# Altium schematic sheet Output Devices.SchDoc
size A; SheetNumber: 5; SheetTotal: 5
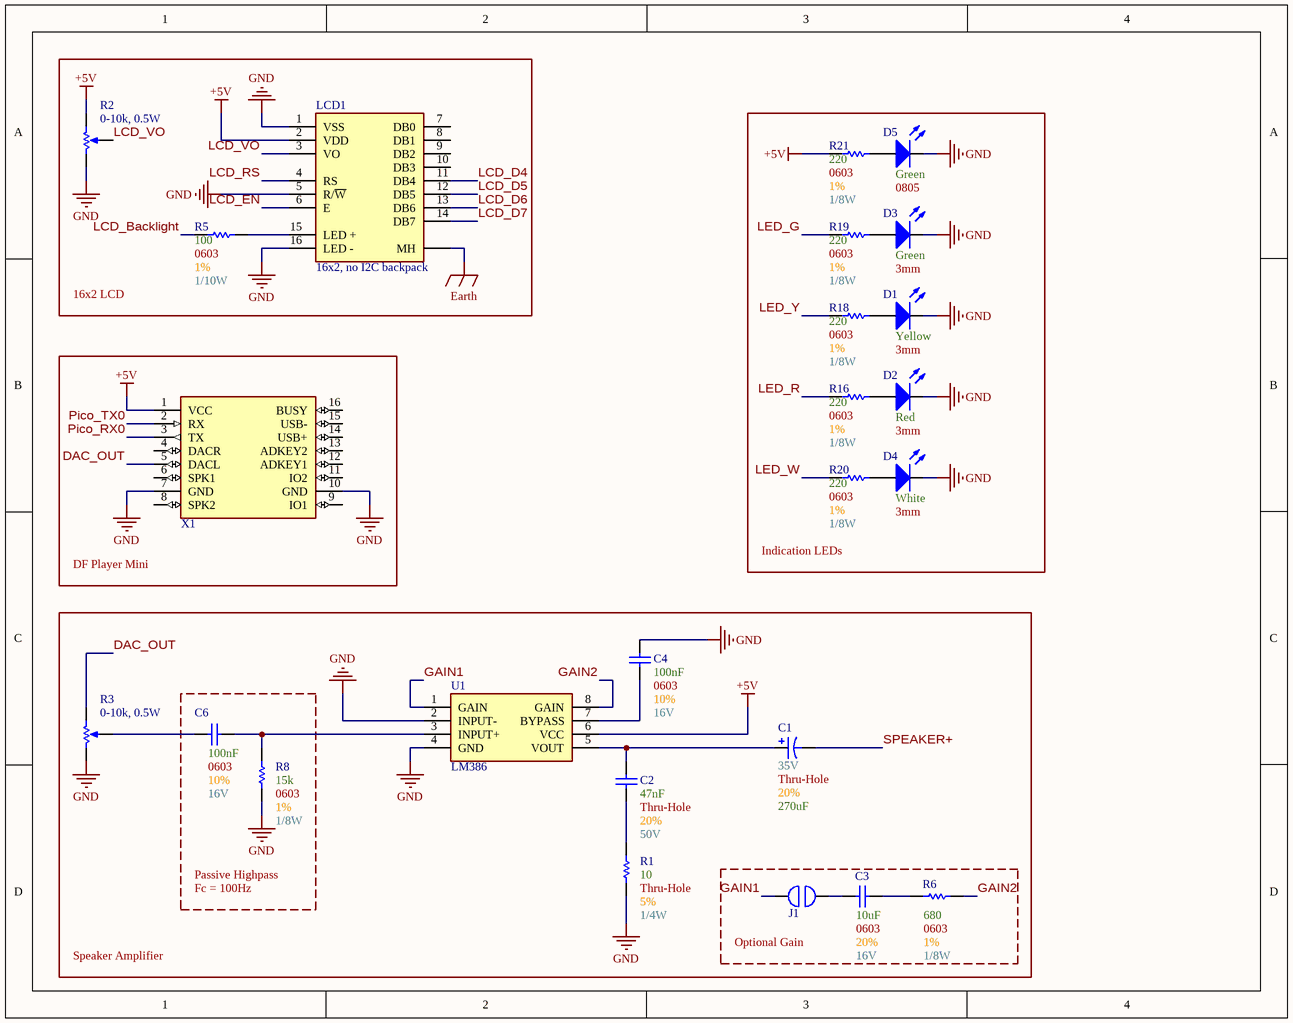
[diagram p0: Output Devices.SchDoc]

## Parts
C1  Max Voltage: 35V  Size Package: Thru-Hole  Tolerance: 20%  Capacitance: 270uF  [[Cap] Thru-Hole Polarized 8mm]  (hidden comment: [Cap] Thru-Hole 270uF 20% 35V)
C2  Max Voltage: 50V  Size Package: Thru-Hole  Tolerance: 20%  Capacitance: 47nF  [[Cap] Thru-Hole Nonpolarized Ceramic]  (hidden comment: [Cap] Thru-Hole 47nF 20% 50V)
C3  Max Voltage: 16V  Size Package: 0603  Tolerance: 20%  Capacitance: 10uF  [[Cap] SMD 0603]  (hidden comment: [Cap] 0603 10uF 20% 16V)
C4  Max Voltage: 16V  Size Package: 0603  Tolerance: 10%  Capacitance: 100nF  [[Cap] SMD 0603]  (hidden comment: [Cap] 0603 0.1uF 10% 16V)
C6  Max Voltage: 16V  Size Package: 0603  Tolerance: 10%  Capacitance: 100nF  [[Cap] SMD 0603]  (hidden comment: [Cap] 0603 0.1uF 10% 16V)
D1  Color: Yellow  Lens Diameter: 3mm  [[LED] Thru-Hole 3mm Yellow]  (hidden comment: [LED] Thru-Hole 3mm Yellow)
D2  Color: Red  Lens Diameter: 3mm  [[LED] Thru-Hole 3mm Red]  (hidden comment: [LED] Thru-Hole 3mm Red)
D3  Color: Green  Lens Diameter: 3mm  [[LED] Thru-Hole 3mm Green]  (hidden comment: [LED] Thru-Hole 3mm Green)
D4  Color: White  Lens Diameter: 3mm  [[LED] Thru-Hole 3mm White]  (hidden comment: [LED] Thru-Hole 3mm White)
D5  Color: Green  Size Package: 0805  [[LED] SMD 0805]  (hidden comment: [LED] SMD 0805 Green)
J1  [Jumper] Thru-Hole 2pin  [[Jumper] Thru-Hole 2pin]  (value not drawn)
LCD1  16x2, no I2C backpack  [[LCD] 16x2 Parallel]
R1  Size Package: Thru-Hole  Wattage: 1/4W  Tolerance: 5%  Resistance: 10  [[Res] Thru-Hole 1/4W]  (hidden comment: [10] Thru-Hole 5% 1/4W)
R2  0-10k, 0.5W  [[Potentiometer] 10k 0.5W (2)]
R3  0-10k, 0.5W  [[Potentiometer] 10k 0.5W (2)]
R5  Wattage: 1/10W  Tolerance: 1%  Resistance: 100  Size Package: 0603  [[Res] SMD 0603]  (hidden comment: [100] SMD 0603 1% 1/10W)
R6  Wattage: 1/8W  Tolerance: 1%  Resistance: 680  Size Package: 0603  [[Res] SMD 0603]  (hidden comment: [680] SMD 0603 1% 1/8W)
R8  Wattage: 1/8W  Tolerance: 1%  Resistance: 15k  Size Package: 0603  [[Res] SMD 0603]  (hidden comment: [15k] SMD 0603 1% 1/8W)
R16  Wattage: 1/8W  Tolerance: 1%  Resistance: 220  Size Package: 0603  [[Res] SMD 0603]  (hidden comment: [220] SMD 0603 1% 1/10W)
R18  Wattage: 1/8W  Tolerance: 1%  Resistance: 220  Size Package: 0603  [[Res] SMD 0603]  (hidden comment: [220] SMD 0603 1% 1/10W)
R19  Wattage: 1/8W  Tolerance: 1%  Resistance: 220  Size Package: 0603  [[Res] SMD 0603]  (hidden comment: [220] SMD 0603 1% 1/10W)
R20  Wattage: 1/8W  Tolerance: 1%  Resistance: 220  Size Package: 0603  [[Res] SMD 0603]  (hidden comment: [220] SMD 0603 1% 1/10W)
R21  Wattage: 1/8W  Tolerance: 1%  Resistance: 220  Size Package: 0603  [[Res] SMD 0603]  (hidden comment: [220] SMD 0603 1% 1/10W)
U1  LM386  [[Amp] LM386]
X1  [MP3] DFPlayer Mini MP3 Player  [[MP3] DFPlayer Mini MP3 Player]  (value not drawn)

## Blocks framed on the sheet
16x2 LCD: LCD1 R2 R5
Indication LEDs: D1-D5 R16 R18-R21
DF Player Mini: X1
Optional Gain: C3 J1 R6

## Nets
+5V: LCD1.2(VDD) R2.1(TOP) R21.1 U1.6(VCC) X1.1(VCC)
Earth: LCD1.MH
GND: C4.2 D1.2(Cathode) D2.2(Cathode) D3.2(Cathode) D4.2(Cathode) D5.2(Cathode) LCD1.1(VSS) LCD1.5(R/~{W}) LCD1.16(LED_-) R1.1 R2.3(BOT) R3.3(BOT) R8.1 U1.2(INPUT-) U1.4(GND) X1.7(GND) X1.10(GND)
DAC_OUT: R3.1(TOP) X1.5(DACL)
GAIN1: J1.1 U1.1(GAIN)
GAIN2: R6.2 U1.8(GAIN)
LCD_Backlight: R5.1
LCD_D4: LCD1.11(DB4)
LCD_D5: LCD1.12(DB5)
LCD_D6: LCD1.13(DB6)
LCD_D7: LCD1.14(DB7)
LCD_EN: LCD1.6(E)
LCD_RS: LCD1.4(RS)
LCD_VO: LCD1.3(VO) R2.2(TAP)
LED_G: R19.1
LED_R: R16.1
LED_W: R20.1
LED_Y: R18.1
Pico_RX0: X1.3(TX)
Pico_TX0: X1.2(RX)
SPEAKER+: C1.2
NetC1_1: C1.1 C2.2 U1.5(VOUT)
NetC2_1: C2.1 R1.2
NetC3_1: C3.1 J1.2
NetC3_2: C3.2 R6.1
NetC4_1: C4.1 U1.7(BYPASS)
NetC6_1: C6.1 R8.2 U1.3(INPUT+)
NetC6_2: C6.2 R3.2(TAP)
NetD1_1: D1.1(Anode) R18.2
NetD2_1: D2.1(Anode) R16.2
NetD3_1: D3.1(Anode) R19.2
NetD4_1: D4.1(Anode) R20.2
NetD5_1: D5.1(Anode) R21.2
NetLCD1_15: LCD1.15(LED_+) R5.2

Not connected (* = marked no-connect by the designer): LCD1 7(DB0) 8(DB1) 9(DB2) 10(DB3); X1 4(DACR) 6(SPK1) 8(SPK2) 9(IO1) 11(IO2) 12(ADKEY1) 13(ADKEY2) 14(USB+) 15(USB-) 16(BUSY)

## Notes on the sheet
- Passive Highpass
- Fc = 100Hz
- Speaker Amplifier

## Library data of the parts
C1 = [Cap] Thru-Hole 270uF 20% 35V: 35ZLH270MEFC8X16; Supplier 1: DigiKey; Supplier Part Number 1: 1189-1748-ND
C2 = [Cap] Thru-Hole 47nF 20% 50V: C317C473M5U5TA; Supplier 1: DigiKey; Supplier Part Number 1: 399-4246-ND
C3 = [Cap] 0603 10uF 20% 16V: GRM188C81C106MA73D; Supplier 1: DigiKey; Supplier Part Number 1: 490-7198-1-ND
C4 C6 = [Cap] 0603 0.1uF 10% 16V: CC0603KRX7R7BB104; Supplier 1: DigiKey; Supplier Part Number 1: 311-1088-6-ND
D1 = [LED] Thru-Hole 3mm Yellow: 151031YS05900; Supplier 1: DigiKey; Supplier Part Number 1: 732-5009-ND
D2 = [LED] Thru-Hole 3mm Red: 151031SS06000; Supplier 1: DigiKey; Supplier Part Number 1: 732-5006-ND
D3 = [LED] Thru-Hole 3mm Green: 151031VS06000; Supplier 1: DigiKey; Supplier Part Number 1: 732-5008-ND
D4 = [LED] Thru-Hole 3mm White: 151031VS06000; Supplier 1: DigiKey; Supplier Part Number 1: 1516-QBL7IW60D-WW-ND
D5 = [LED] SMD 0805 Green: LG R971-KN-1-0-20-R18; Supplier 1: DigiKey; Supplier Part Number 1: 475-LGR971-KN-1CT-ND
LCD1 = [LCD] 16x2 Parallel: Sunfounder
R1 = [10] Thru-Hole 5% 1/4W: CFR-25JT-52-10R; Supplier 1: DigiKey; Supplier Part Number 1: 13-CFR-25JT-52-10RCT-ND
R2 R3 = [Potentiometer] 10k 0.5W: 3386T-1-103LF; Supplier 1: DigiKey; Supplier Part Number 1: 118-3386T-1-103LF-ND
R5 = [100] SMD 0603 1% 1/10W: RC0603FR-07100RL; Supplier 1: DigiKey; Supplier Part Number 1: 311-100HRDKR-ND
R6 = [680] SMD 0603 1% 1/8W: CRCW0603680RFKEA; Supplier 1: DigiKey; Supplier Part Number 1: 541-680HCT-ND
R8 = [15k] SMD 0603 1% 1/8W: CRCW060315K0FKEA; Supplier 1: DigiKey; Supplier Part Number 1: 541-15.0KHCT-ND
R16 R18-R21 = [220] SMD 0603 1% 1/10W: CRGCQ0805F220R; Supplier 1: DigiKey; Supplier Part Number 1: A129741CT-ND
U1 = [Amp] LM386: LM386N-1/NOPB; Supplier 1: DigiKey; Supplier Part Number 1: 296-44414-5-ND
X1 = [MP3] DFPlayer Mini MP3 Player: DFR0299; Supplier 1: DigiKey; Supplier Part Number 1: 1738-1041-ND